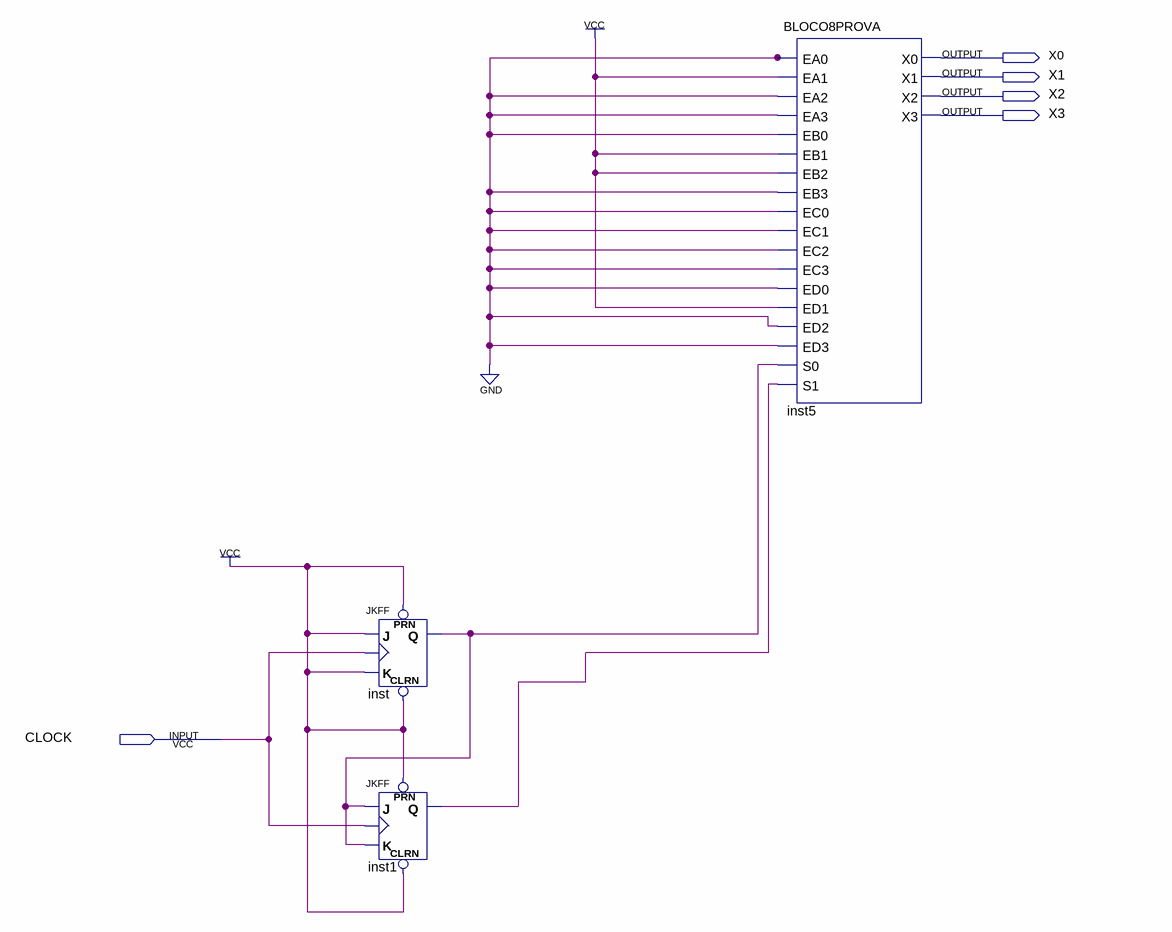
[diagram p0: schematic sheet]
// Quartus schematic PROVA01EX08.bdf as structural Verilog: 3 symbols, 5 pins
module PROVA01EX08 (
  input  CLOCK,
  output X0,
  output X1,
  output X2,
  output X3
);

  wire inst1_q, inst_q;

  JKFF inst (.PRN(1'b1), .CLRN(1'b1), .K(1'b1), .J(1'b1), .CLK(CLOCK), .Q(inst_q));
  JKFF inst1 (.PRN(1'b1), .CLRN(1'b1), .K(inst_q), .J(inst_q), .CLK(CLOCK), .Q(inst1_q));
  BLOCO8PROVA inst5 (
    .EA0(1'b0), .EA1(1'b1), .EA2(1'b0), .EA3(1'b0), .EB0(1'b0), .EB1(1'b1), .EB2(1'b1), .EB3(1'b0),
    .EC0(1'b0), .EC1(1'b0), .EC2(1'b0), .EC3(1'b0), .ED0(1'b0), .ED1(1'b1), .ED2(1'b0), .ED3(1'b0),
    .S0(inst_q), .S1(inst1_q), .X0(X0), .X1(X1), .X2(X2), .X3(X3));
endmodule
